# Altium schematic sheet LT1990(Input2).SchDoc
size E; SheetNumber: 5; SheetTotal: 6
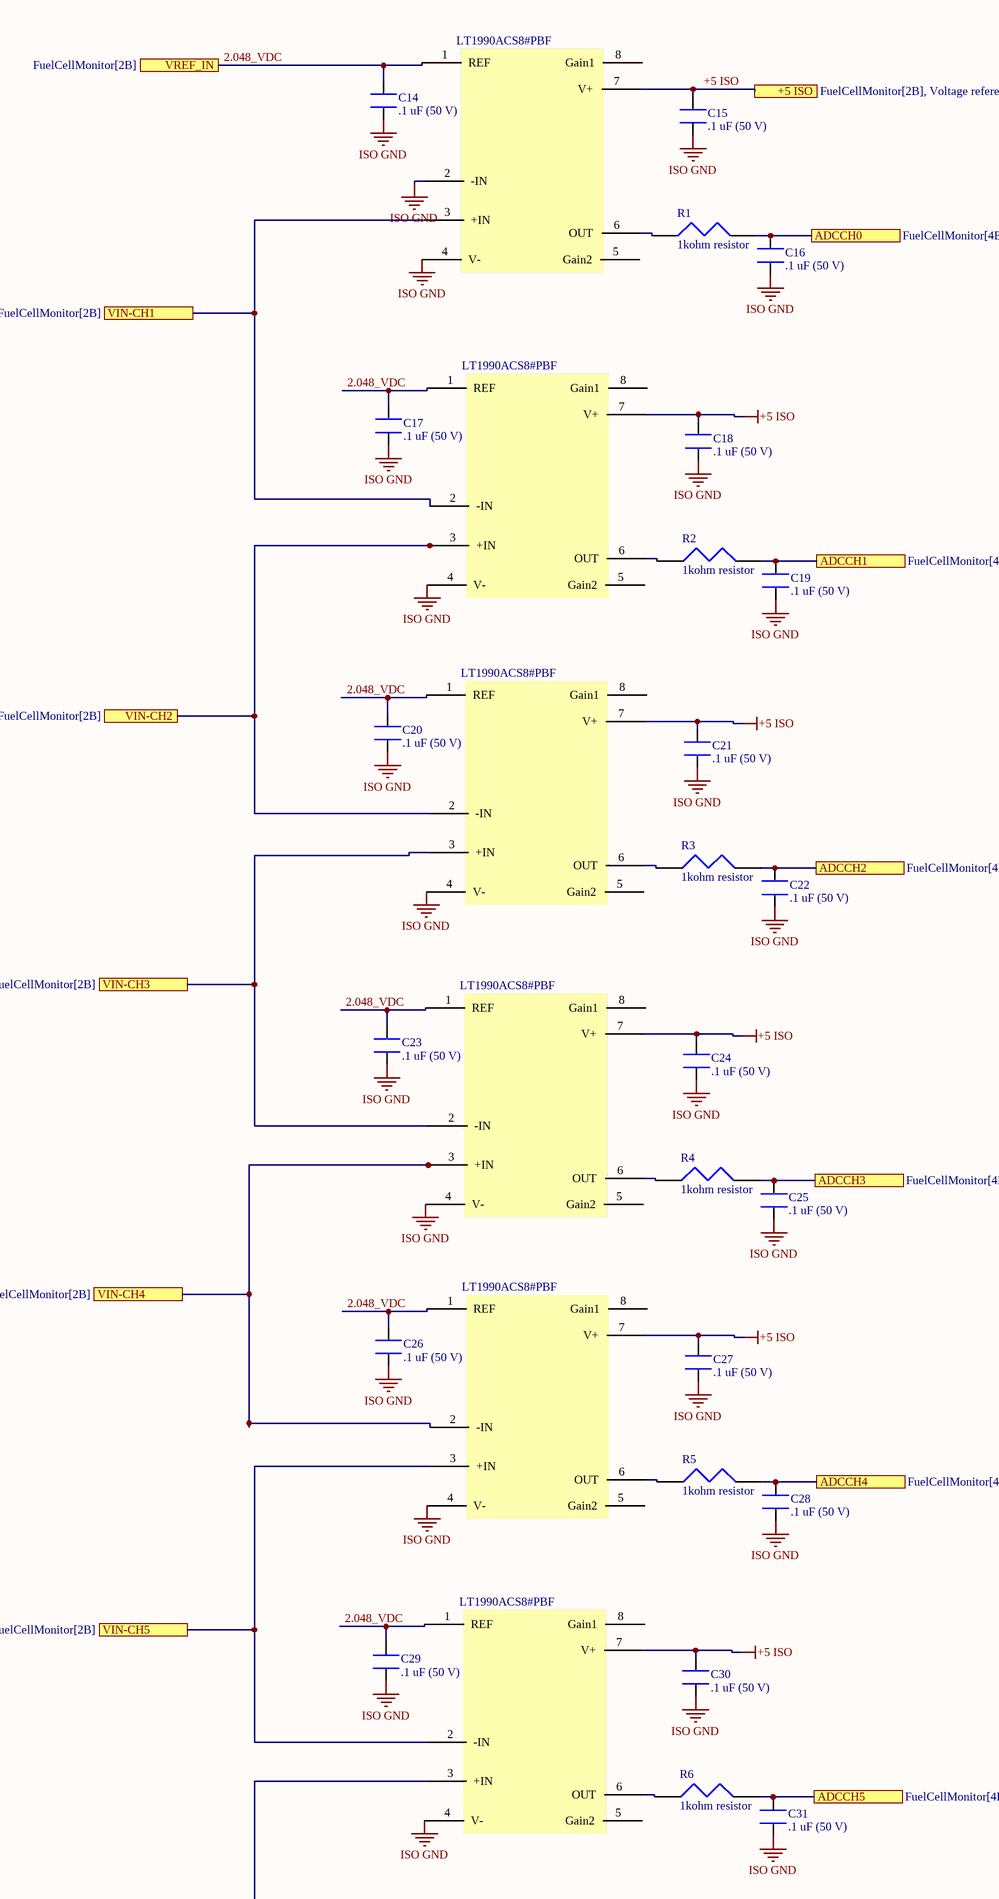
[diagram p0: LT1990(Input2).SchDoc, top left]
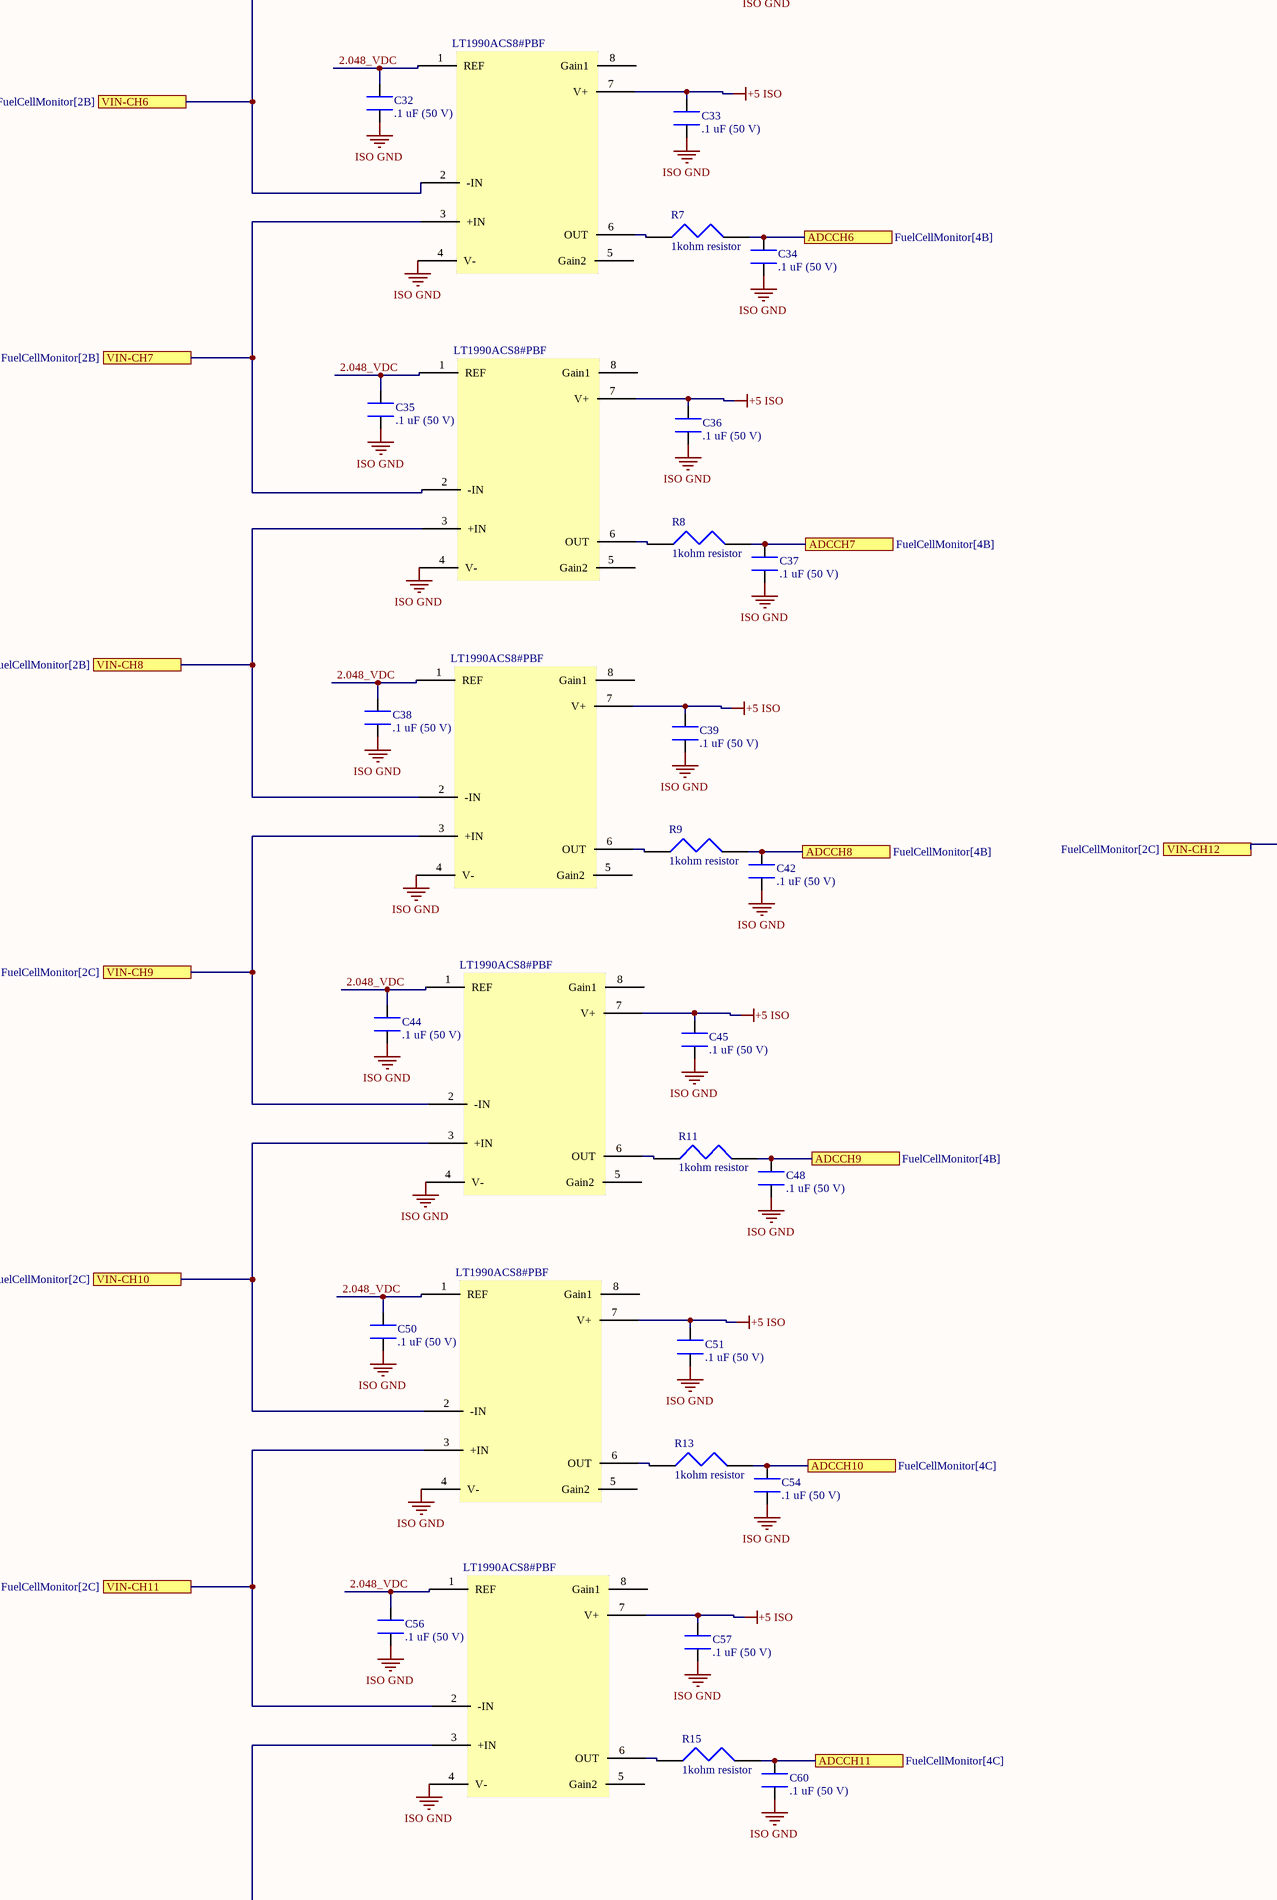
[diagram p1: LT1990(Input2).SchDoc, bottom left]
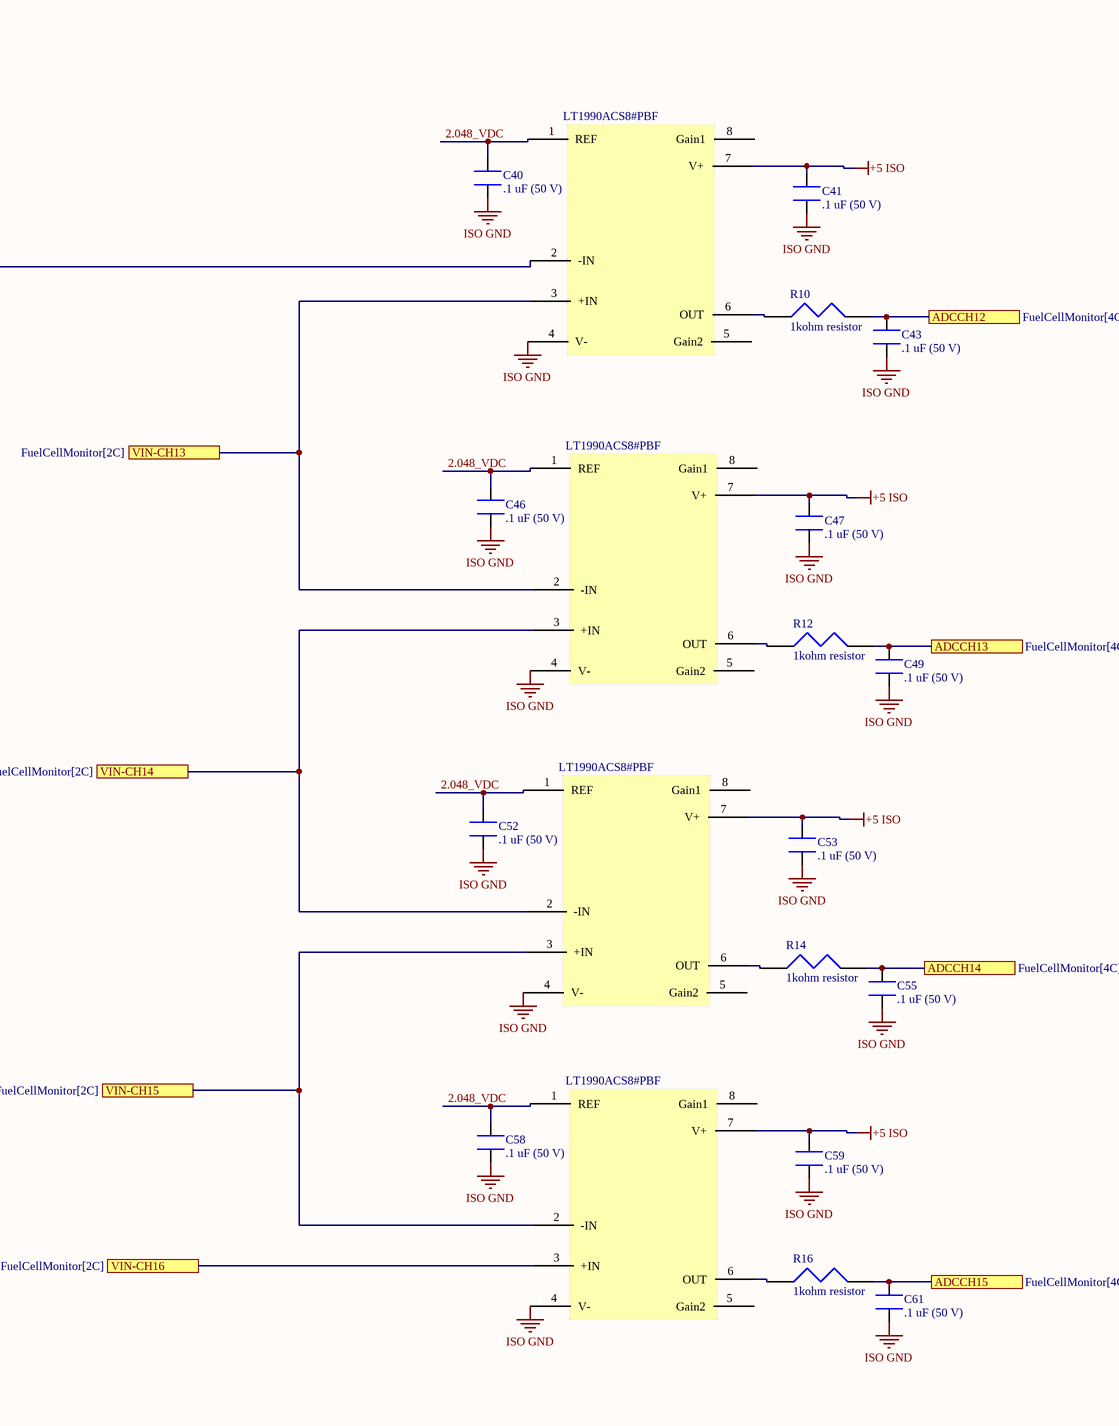
[diagram p2: LT1990(Input2).SchDoc, bottom right]

## Parts
C14  .1 uF (50 V)  [.1uF capacitor]
C15  .1 uF (50 V)  [.1uF capacitor]
C16  .1 uF (50 V)  [.1uF capacitor]
C17  .1 uF (50 V)  [.1uF capacitor]
C18  .1 uF (50 V)  [.1uF capacitor]
C19  .1 uF (50 V)  [.1uF capacitor]
C20  .1 uF (50 V)  [.1uF capacitor]
C21  .1 uF (50 V)  [.1uF capacitor]
C22  .1 uF (50 V)  [.1uF capacitor]
C23  .1 uF (50 V)  [.1uF capacitor]
C24  .1 uF (50 V)  [.1uF capacitor]
C25  .1 uF (50 V)  [.1uF capacitor]
C26  .1 uF (50 V)  [.1uF capacitor]
C27  .1 uF (50 V)  [.1uF capacitor]
C28  .1 uF (50 V)  [.1uF capacitor]
C29  .1 uF (50 V)  [.1uF capacitor]
C30  .1 uF (50 V)  [.1uF capacitor]
C31  .1 uF (50 V)  [.1uF capacitor]
C32  .1 uF (50 V)  [.1uF capacitor]
C33  .1 uF (50 V)  [.1uF capacitor]
C34  .1 uF (50 V)  [.1uF capacitor]
C35  .1 uF (50 V)  [.1uF capacitor]
C36  .1 uF (50 V)  [.1uF capacitor]
C37  .1 uF (50 V)  [.1uF capacitor]
C38  .1 uF (50 V)  [.1uF capacitor]
C39  .1 uF (50 V)  [.1uF capacitor]
C40  .1 uF (50 V)  [.1uF capacitor]
C41  .1 uF (50 V)  [.1uF capacitor]
C42  .1 uF (50 V)  [.1uF capacitor]
C43  .1 uF (50 V)  [.1uF capacitor]
C44  .1 uF (50 V)  [.1uF capacitor]
C45  .1 uF (50 V)  [.1uF capacitor]
C46  .1 uF (50 V)  [.1uF capacitor]
C47  .1 uF (50 V)  [.1uF capacitor]
C48  .1 uF (50 V)  [.1uF capacitor]
C49  .1 uF (50 V)  [.1uF capacitor]
C50  .1 uF (50 V)  [.1uF capacitor]
C51  .1 uF (50 V)  [.1uF capacitor]
C52  .1 uF (50 V)  [.1uF capacitor]
C53  .1 uF (50 V)  [.1uF capacitor]
C54  .1 uF (50 V)  [.1uF capacitor]
C55  .1 uF (50 V)  [.1uF capacitor]
C56  .1 uF (50 V)  [.1uF capacitor]
C57  .1 uF (50 V)  [.1uF capacitor]
C58  .1 uF (50 V)  [.1uF capacitor]
C59  .1 uF (50 V)  [.1uF capacitor]
C60  .1 uF (50 V)  [.1uF capacitor]
C61  .1 uF (50 V)  [.1uF capacitor]
LT1  LT1990  [LT1990ACS8]  (value not drawn)
LT2  LT1990  [LT1990ACS8]  (value not drawn)
LT3  LT1990  [LT1990ACS8]  (value not drawn)
LT4  LT1990  [LT1990ACS8]  (value not drawn)
LT5  LT1990  [LT1990ACS8]  (value not drawn)
LT6  LT1990  [LT1990ACS8]  (value not drawn)
LT7  LT1990  [LT1990ACS8]  (value not drawn)
LT8  LT1990  [LT1990ACS8]  (value not drawn)
LT9  LT1990  [LT1990ACS8]  (value not drawn)
LT10  LT1990  [LT1990ACS8]  (value not drawn)
LT11  LT1990  [LT1990ACS8]  (value not drawn)
LT12  LT1990  [LT1990ACS8]  (value not drawn)
LT13  LT1990  [LT1990ACS8]  (value not drawn)
LT14  LT1990  [LT1990ACS8]  (value not drawn)
LT15  LT1990  [LT1990ACS8]  (value not drawn)
LT16  LT1990  [LT1990ACS8]  (value not drawn)
R1  1kohm resistor  [1kohm resistor]
R2  1kohm resistor  [1kohm resistor]
R3  1kohm resistor  [1kohm resistor]
R4  1kohm resistor  [1kohm resistor]
R5  1kohm resistor  [1kohm resistor]
R6  1kohm resistor  [1kohm resistor]
R7  1kohm resistor  [1kohm resistor]
R8  1kohm resistor  [1kohm resistor]
R9  1kohm resistor  [1kohm resistor]
R10  1kohm resistor  [1kohm resistor]
R11  1kohm resistor  [1kohm resistor]
R12  1kohm resistor  [1kohm resistor]
R13  1kohm resistor  [1kohm resistor]
R14  1kohm resistor  [1kohm resistor]
R15  1kohm resistor  [1kohm resistor]
R16  1kohm resistor  [1kohm resistor]

## Ports
+5 ISO (see FuelCellMonitor[2B], Voltage reference[2B]), ADCCH0 (see FuelCellMonitor[4B]), ADCCH1 (see FuelCellMonitor[4B]), ADCCH2 (see FuelCellMonitor[4B]), ADCCH3 (see FuelCellMonitor[4B]), ADCCH4 (see FuelCellMonitor[4B]), ADCCH5 (see FuelCellMonitor[4B]), ADCCH6 (see FuelCellMonitor[4B]), ADCCH7 (see FuelCellMonitor[4B]), ADCCH8 (see FuelCellMonitor[4B]), ADCCH9 (see FuelCellMonitor[4B]), ADCCH10 (see FuelCellMonitor[4C]), ADCCH11 (see FuelCellMonitor[4C]), ADCCH12 (see FuelCellMonitor[4C]), ADCCH13 (see FuelCellMonitor[4C]), ADCCH14 (see FuelCellMonitor[4C]), ADCCH15 (see FuelCellMonitor[4C]), VIN-CH1 (see FuelCellMonitor[2B]), VIN-CH2 (see FuelCellMonitor[2B]), VIN-CH3 (see FuelCellMonitor[2B]), VIN-CH4 (see FuelCellMonitor[2B]), VIN-CH5 (see FuelCellMonitor[2B]), VIN-CH6 (see FuelCellMonitor[2B]), VIN-CH7 (see FuelCellMonitor[2B]), VIN-CH8 (see FuelCellMonitor[2B]), VIN-CH9 (see FuelCellMonitor[2C]), VIN-CH10 (see FuelCellMonitor[2C]), VIN-CH11 (see FuelCellMonitor[2C]), VIN-CH12 (see FuelCellMonitor[2C]), VIN-CH13 (see FuelCellMonitor[2C]), VIN-CH14 (see FuelCellMonitor[2C]), VIN-CH15 (see FuelCellMonitor[2C]), VIN-CH16 (see FuelCellMonitor[2C]), VREF_IN (see FuelCellMonitor[2B])

## Nets
+5 ISO: C15.2 C18.2 C21.2 C24.2 C27.2 C30.2 C33.2 C36.2 C39.2 C41.2 C45.2 C47.2 C51.2 C53.2 C57.2 C59.2 LT1.7(V+) LT2.7(V+) LT3.7(V+) LT4.7(V+) LT5.7(V+) LT6.7(V+) LT7.7(V+) LT8.7(V+) LT9.7(V+) LT10.7(V+) LT11.7(V+) LT12.7(V+) LT13.7(V+) LT14.7(V+) LT15.7(V+) LT16.7(V+) ; port +5 ISO
ISO GND: C14.1 C15.1 C16.1 C17.1 C18.1 C19.1 C20.1 C21.1 C22.1 C23.1 C24.1 C25.1 C26.1 C27.1 C28.1 C29.1 C30.1 C31.1 C32.1 C33.1 C34.1 C35.1 C36.1 C37.1 C38.1 C39.1 C40.1 C41.1 C42.1 C43.1 C44.1 C45.1 C46.1 C47.1 C48.1 C49.1 C50.1 C51.1 C52.1 C53.1 C54.1 C55.1 C56.1 C57.1 C58.1 C59.1 C60.1 C61.1 LT1.2(-IN) LT1.4(V-) LT2.4(V-) LT3.4(V-) LT4.4(V-) LT5.4(V-) LT6.4(V-) LT7.4(V-) LT8.4(V-) LT9.4(V-) LT10.4(V-) LT11.4(V-) LT12.4(V-) LT13.4(V-) LT14.4(V-) LT15.4(V-) LT16.4(V-)
2.048_VDC: C14.2 C17.2 C20.2 C23.2 C26.2 C29.2 C32.2 C35.2 C38.2 C40.2 C44.2 C46.2 C50.2 C52.2 C56.2 C58.2 LT1.1(REF) LT2.1(REF) LT3.1(REF) LT4.1(REF) LT5.1(REF) LT6.1(REF) LT7.1(REF) LT8.1(REF) LT9.1(REF) LT10.1(REF) LT11.1(REF) LT12.1(REF) LT13.1(REF) LT14.1(REF) LT15.1(REF) LT16.1(REF) ; port VREF_IN
ADCCH0: C16.2 R1.2 ; port ADCCH0
ADCCH1: C19.2 R2.2 ; port ADCCH1
ADCCH2: C22.2 R3.2 ; port ADCCH2
ADCCH3: C25.2 R4.2 ; port ADCCH3
ADCCH4: C28.2 R5.2 ; port ADCCH4
ADCCH5: C31.2 R6.2 ; port ADCCH5
ADCCH6: C34.2 R7.2 ; port ADCCH6
ADCCH7: C37.2 R8.2 ; port ADCCH7
ADCCH8: C42.2 R9.2 ; port ADCCH8
ADCCH9: C48.2 R11.2 ; port ADCCH9
ADCCH10: C54.2 R13.2 ; port ADCCH10
ADCCH11: C60.2 R15.2 ; port ADCCH11
ADCCH12: C43.2 R10.2 ; port ADCCH12
ADCCH13: C49.2 R12.2 ; port ADCCH13
ADCCH14: C55.2 R14.2 ; port ADCCH14
ADCCH15: C61.2 R16.2 ; port ADCCH15
VIN-CH1: LT1.3(+IN) LT2.2(-IN) ; port VIN-CH1
VIN-CH2: LT2.3(+IN) LT3.2(-IN) ; port VIN-CH2
VIN-CH3: LT3.3(+IN) LT4.2(-IN) ; port VIN-CH3
VIN-CH4: LT4.3(+IN) LT5.2(-IN) ; port VIN-CH4
VIN-CH5: LT5.3(+IN) LT6.2(-IN) ; port VIN-CH5
VIN-CH6: LT6.3(+IN) LT7.2(-IN) ; port VIN-CH6
VIN-CH7: LT7.3(+IN) LT8.2(-IN) ; port VIN-CH7
VIN-CH8: LT8.3(+IN) LT9.2(-IN) ; port VIN-CH8
VIN-CH9: LT9.3(+IN) LT10.2(-IN) ; port VIN-CH9
VIN-CH10: LT10.3(+IN) LT11.2(-IN) ; port VIN-CH10
VIN-CH11: LT11.3(+IN) LT12.2(-IN) ; port VIN-CH11
VIN-CH12: LT12.3(+IN) LT13.2(-IN) ; port VIN-CH12
VIN-CH13: LT13.3(+IN) LT14.2(-IN) ; port VIN-CH13
VIN-CH14: LT14.3(+IN) LT15.2(-IN) ; port VIN-CH14
VIN-CH15: LT15.3(+IN) LT16.2(-IN) ; port VIN-CH15
VIN-CH16: LT16.3(+IN) ; port VIN-CH16
NetLT1_6: LT1.6(OUT) R1.1
NetLT2_6: LT2.6(OUT) R2.1
NetLT3_6: LT3.6(OUT) R3.1
NetLT4_6: LT4.6(OUT) R4.1
NetLT5_6: LT5.6(OUT) R5.1
NetLT6_6: LT6.6(OUT) R6.1
NetLT7_6: LT7.6(OUT) R7.1
NetLT8_6: LT8.6(OUT) R8.1
NetLT9_6: LT9.6(OUT) R9.1
NetLT10_6: LT10.6(OUT) R11.1
NetLT11_6: LT11.6(OUT) R13.1
NetLT12_6: LT12.6(OUT) R15.1
NetLT13_6: LT13.6(OUT) R10.1
NetLT14_6: LT14.6(OUT) R12.1
NetLT15_6: LT15.6(OUT) R14.1
NetLT16_6: LT16.6(OUT) R16.1

Not connected (* = marked no-connect by the designer): LT1 5(Gain2) 8(Gain1); LT2 5(Gain2) 8(Gain1); LT3 5(Gain2) 8(Gain1); LT4 5(Gain2) 8(Gain1); LT5 5(Gain2) 8(Gain1); LT6 5(Gain2) 8(Gain1); LT7 5(Gain2) 8(Gain1); LT8 5(Gain2) 8(Gain1); LT9 5(Gain2) 8(Gain1); LT10 5(Gain2) 8(Gain1); LT11 5(Gain2) 8(Gain1); LT12 5(Gain2) 8(Gain1); LT13 5(Gain2) 8(Gain1); LT14 5(Gain2) 8(Gain1); LT15 5(Gain2) 8(Gain1); LT16 5(Gain2) 8(Gain1)

## Notes on the sheet
- (in symbol LT1990) LT1990ACS8#PBF

## Library data of the parts
C14-C61 = .1 uF cap